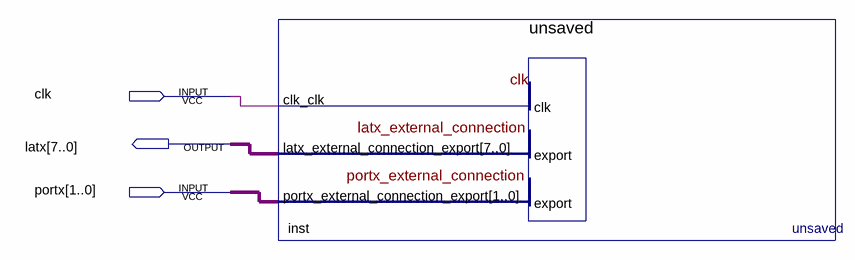
[diagram p0: schematic sheet]
// Quartus schematic GPIO_Nios.bdf as structural Verilog: 1 symbols, 3 pins
module GPIO_Nios (
  input  clk,
  input  [1:0] portx,
  output [7:0] latx
);

  unsaved inst (.clk_clk(clk), .portx_external_connection_export(portx), .latx_external_connection_export(latx));
endmodule
